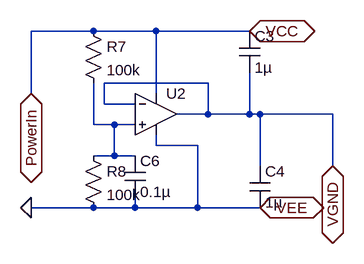
[diagram p0: schematic E24DualPowrSupply.asc]
E24DualPowrSupply.asc, the LTspice schematic file:
Version 4.1
SHEET 1 2084 680
WIRE -752 -352 -848 -352
WIRE -656 -352 -752 -352
WIRE -512 -352 -656 -352
WIRE -576 -272 -736 -272
WIRE -848 -256 -848 -352
WIRE -656 -256 -656 -352
WIRE -736 -240 -736 -272
WIRE -688 -240 -736 -240
WIRE -576 -224 -576 -272
WIRE -576 -224 -624 -224
WIRE -512 -224 -512 -288
WIRE -512 -224 -576 -224
WIRE -496 -224 -512 -224
WIRE -384 -224 -496 -224
WIRE -752 -208 -752 -272
WIRE -720 -208 -752 -208
WIRE -688 -208 -720 -208
WIRE -656 -176 -656 -192
WIRE -592 -176 -656 -176
WIRE -720 -160 -720 -208
WIRE -720 -160 -752 -160
WIRE -688 -160 -720 -160
WIRE -496 -144 -496 -224
WIRE -384 -144 -384 -224
WIRE -752 -80 -848 -80
WIRE -688 -80 -688 -96
WIRE -688 -80 -752 -80
WIRE -592 -80 -592 -176
WIRE -592 -80 -688 -80
WIRE -496 -80 -592 -80
FLAG -384 -144 VGND
IOPIN -384 -144 BiDir
FLAG -512 -352 VCC
IOPIN -512 -352 BiDir
FLAG -496 -80 VEE
IOPIN -496 -80 BiDir
FLAG -848 -256 PowerIn
IOPIN -848 -256 BiDir
FLAG -848 -80 0
SYMBOL cap -528 -352 R0
SYMATTR InstName C3
SYMATTR Value 1µ
SYMBOL cap -512 -144 R0
SYMATTR InstName C4
SYMATTR Value 1µ
SYMBOL res -768 -368 R0
SYMATTR InstName R7
SYMATTR Value 100k
SYMBOL res -768 -176 R0
SYMATTR InstName R8
SYMATTR Value 100k
SYMBOL cap -704 -160 R0
SYMATTR InstName C6
SYMATTR Value 0.1µ
SYMBOL OpAmps\\UniversalOpAmp2 -656 -224 R0
SYMATTR InstName U2

The netlist it stands for:
* E24DualPowrSupply.asc
C3 PowerIn VGND 1µ
C4 VGND 0 1µ
R7 PowerIn N001 100k
R8 N001 0 100k
C6 N001 0 0.1µ
X§U2 N001 VGND PowerIn 0 VGND level2 Avol=1Meg GBW=10Meg Slew=10Meg Ilimit=25m Rail=0 Vos=0 En=0 Enk=0 In=0 Ink=0 Rin=500Meg  ; pins In+ In- V+ V- OUT
.lib UniversalOpAmp2.lib
.backanno
.end